# Altium schematic sheet AIRZAI_LED_SENSE_FLEX_REVA.SchDoc
size B
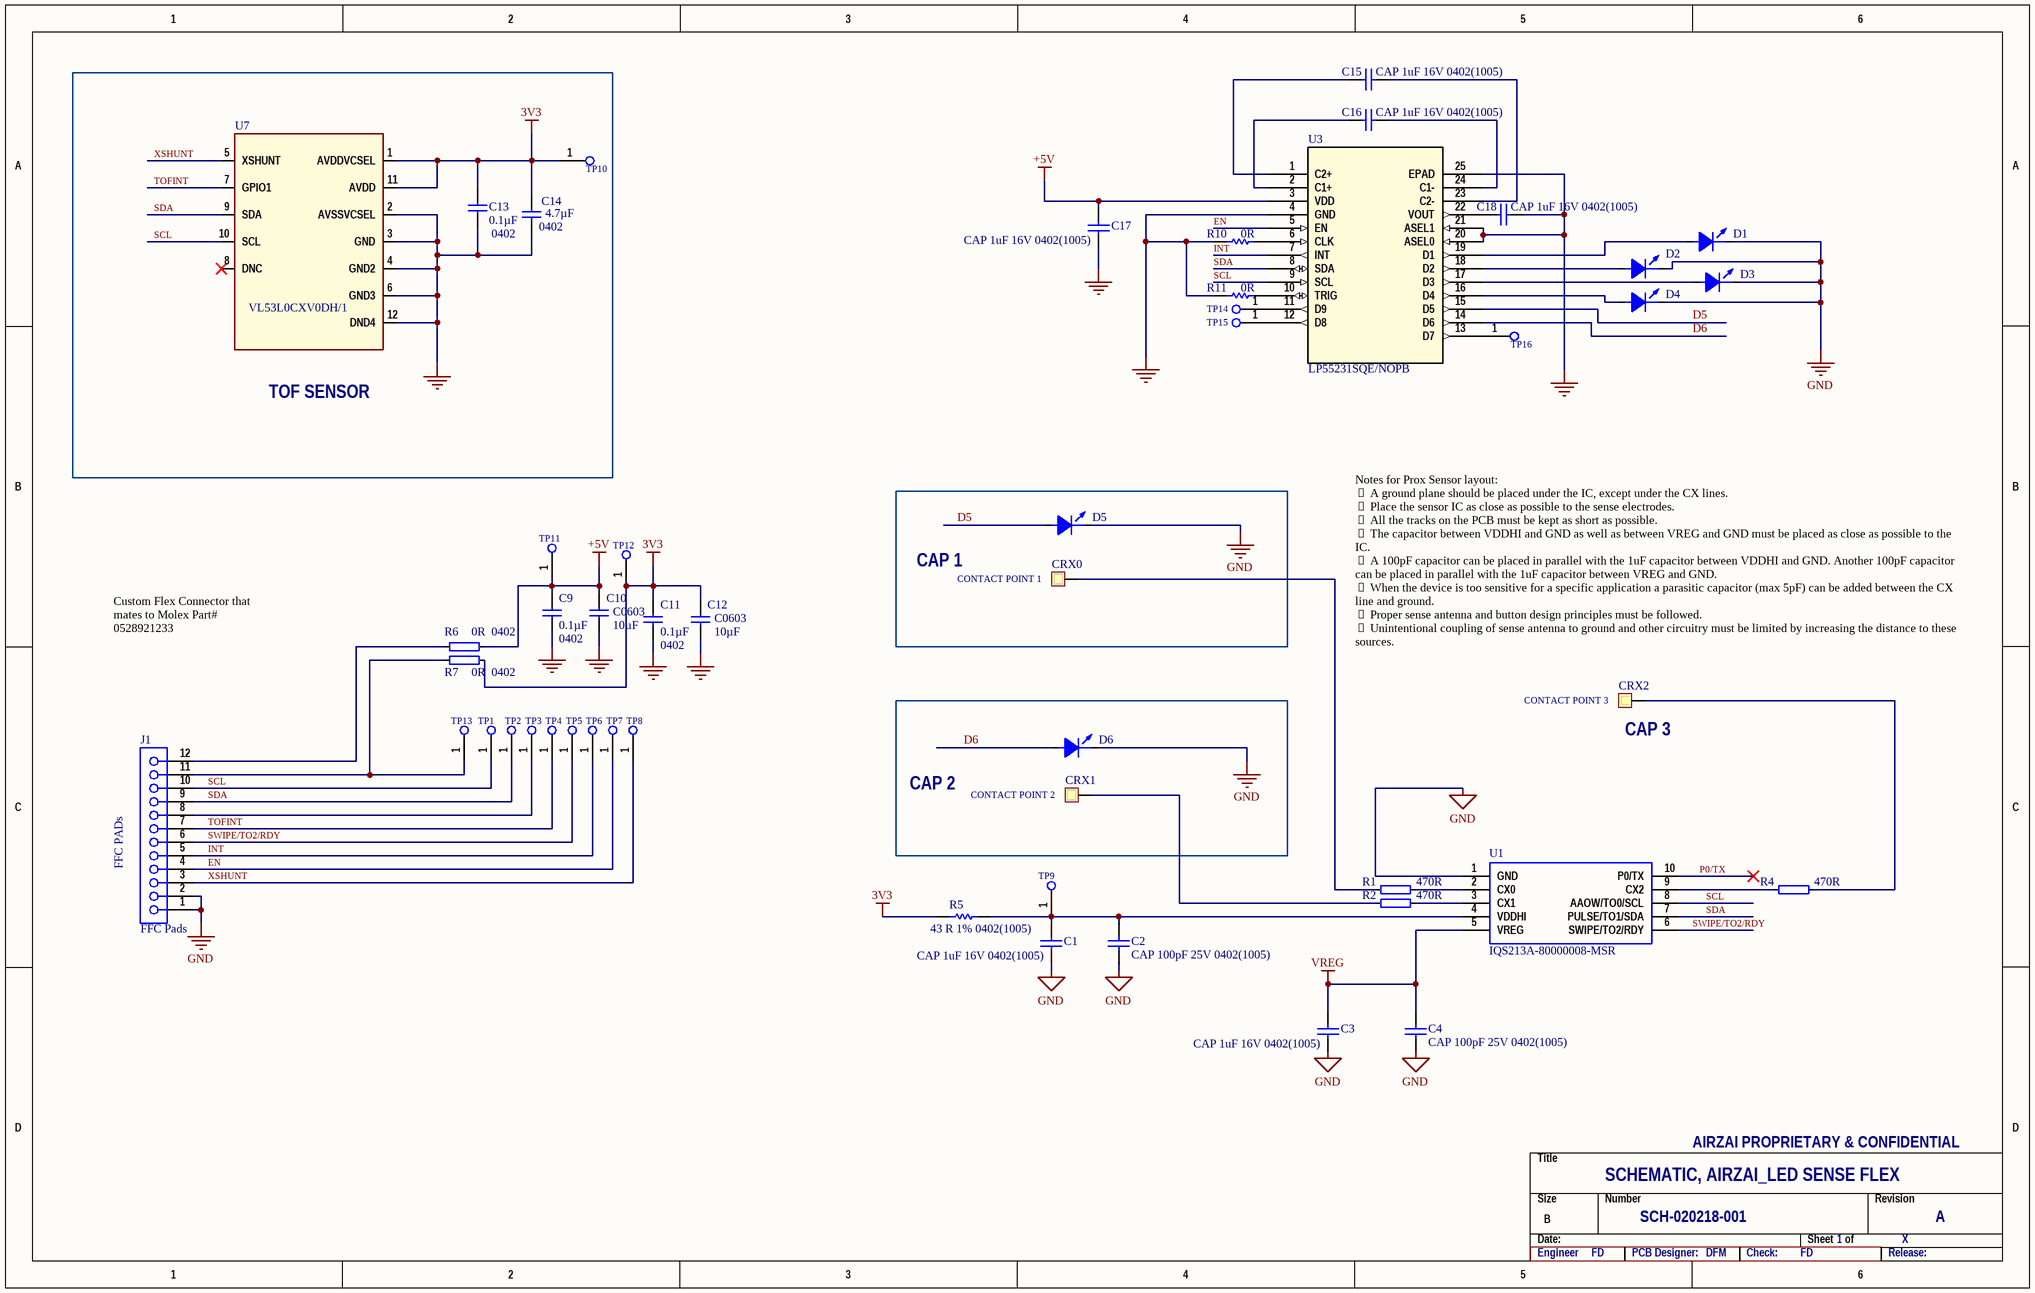
[diagram p0: AIRZAI_LED_SENSE_FLEX_REVA.SchDoc]

## Parts
C1  CAP 1uF 16V 0402(1005)  [0402-A]
C2  CAP 100pF 25V 0402(1005)  [0402-A]
C3  CAP 1uF 16V 0402(1005)  [0402-A]
C4  CAP 100pF 25V 0402(1005)  [0402-A]
C9  0.1µF  Footprint: 0402  [0402CAP]
C10  10µF  Footprint: C0603  [0603]
C11  0.1µF  Footprint: 0402  [0402CAP]
C12  10µF  Footprint: C0603  [0603]
C13  0.1µF  Footprint: 0402  [0402CAP]
C14  4.7µF  Footprint: 0402  [0603]
C15  CAP 1uF 16V 0402(1005)  [CAPC0402(1005)60_M]
C16  CAP 1uF 16V 0402(1005)  [CAPC0402(1005)60_M]
C17  CAP 1uF 16V 0402(1005)  [CAPC0402(1005)60_M]
C18  CAP 1uF 16V 0402(1005)  [CAPC0402(1005)60_M]
CRX0  CONTACT POINT 1  [CONTACT_POINT_1CM _SQ]
CRX1  CONTACT POINT 2  [CONTACT_POINT_1CM _SQ]
CRX2  CONTACT POINT 3  [CONTACT_POINT_0.7CM]
D1  WHITE  [LED1206_LTW-C230DS]  (value not drawn)
D2  WHITE  [LED1206_LTW-C230DS]  (value not drawn)
D3  WHITE  [LED1206_LTW-C230DS]  (value not drawn)
D4  WHITE  [LED1206_LTW-C230DS]  (value not drawn)
D5  WHITE  [LED1206_LTW-C230DS]  (value not drawn)
D6  WHITE  [LED1206_LTW-C230DS]  (value not drawn)
J1  FFC Pads  [FFC_Pads]
R1  470R  [0402-A]
R2  470R  [0402-A]
R4  470R  [0402-A]
R5  43 R 1% 0402(1005)  [0402-A]
R6  0R  [0402]
R7  0R  [0402]
R10  value 0R  [0402]  (hidden comment: Jumper 0402(1005))
R11  value 0R  [0402]  (hidden comment: Jumper 0402(1005))
TP1  Test Point  [TP_0.9MM]  (value not drawn)
TP2  Test Point  [TP_0.9MM]  (value not drawn)
TP3  Test Point  [TP_0.9MM]  (value not drawn)
TP4  Test Point  [TP_0.9MM]  (value not drawn)
TP5  Test Point  [TP_0.9MM]  (value not drawn)
TP6  Test Point  [TP_0.9MM]  (value not drawn)
TP7  Test Point  [TP_0.9MM]  (value not drawn)
TP8  Test Point  [TP_0.9MM]  (value not drawn)
TP9  Test Point  [TP_0.9MM]  (value not drawn)
TP10  Test Point  [TP_0.9MM]  (value not drawn)
TP11  Test Point  [TP_0.9MM]  (value not drawn)
TP12  Test Point  [TP_0.9MM]  (value not drawn)
TP13  Test Point  [TP_0.9MM]  (value not drawn)
TP14  Test Point  [TP_0.9MM]  (value not drawn)
TP15  Test Point  [TP_0.9MM]  (value not drawn)
TP16  Test Point  [TP_0.9MM]  (value not drawn)
U1  IQS213A-80000008-MSR  [MSOP-10-IQS213A-80000008-MSR]
U3  LP55231SQE/NOPB  [WQFN-24-LP55231SQE/NOPB]
U7  VL53L0CXV0DH/1  [VL53L0X]

## Blocks framed on the sheet
TOF SENSOR: C13 C14 TP10 U7
CAP 1: CRX0 D5
CAP 2: CRX1 D6

## Nets
3V3: C11.1 C12.1 C13.1 C14.2 R5.1 R7.1 TP10.1 TP12.1 U7.1(AVDDVCSEL) U7.11(AVDD)
+5V: C9.1 C10.1 C17.2 R6.1 TP11.1 U3.3(VDD)
GND: C1.1 C2.1 C3.1 C4.1 C9.2 C10.2 C11.2 C12.2 C13.2 C14.1 C17.1 C18.2 D1.1(CATHODE) D2.1(CATHODE) D3.1(CATHODE) D4.1(CATHODE) D5.1(CATHODE) D6.1(CATHODE) J1.1 J1.2 R10.1 R11.1 U1.1(GND) U3.4(GND) U3.20(ASEL0) U3.21(ASEL1) U3.25(EPAD) U7.2(AVSSVCSEL) U7.3(GND) U7.4(GND2) U7.6(GND3) U7.12(DND4)
VREG: C3.2 C4.2 U1.5(VREG)
D5: D5.2(ANODE) U3.15(D5)
D6: D6.2(ANODE) U3.14(D6)
EN: J1.4 TP7.1 U3.5(EN)
INT: J1.5 TP6.1 U3.7(INT)
P0/TX: U1.10(P0/TX)
SCL: J1.10 TP1.1 U1.8(AAOW/TO0/SCL) U3.9(SCL) U7.10(SCL)
SDA: J1.9 TP2.1 U1.7(PULSE/TO1/SDA) U3.8(SDA) U7.9(SDA)
SWIPE/TO2/RDY: J1.6 TP5.1 U1.6(SWIPE/TO2/RDY)
TOFINT: J1.7 TP4.1 U7.7(GPIO1)
XSHUNT: J1.3 TP8.1 U7.5(XSHUNT)
NetC1_2: C1.2 C2.2 R5.2 TP9.1 U1.4(VDDHI)
NetC15_1: C15.1 U3.1(C2+)
NetC15_2: C15.2 U3.23(C2-)
NetC16_1: C16.1 U3.2(C1+)
NetC16_2: C16.2 U3.24(C1-)
NetC18_1: C18.1 U3.22(VOUT)
NetCRX0_1: CRX0.1 R1.2
NetCRX1_1: CRX1.1 R2.2
NetCRX2_1: CRX2.1 R4.1
NetD1_2: D1.2(ANODE) U3.19(D1)
NetD2_2: D2.2(ANODE) U3.18(D2)
NetD3_2: D3.2(ANODE) U3.17(D3)
NetD4_2: D4.2(ANODE) U3.16(D4)
NetJ1_8: J1.8 TP3.1
NetJ1_11: J1.11 R7.2 TP13.1
NetJ1_12: J1.12 R6.2
NetR1_1: R1.1 U1.2(CX0)
NetR2_1: R2.1 U1.3(CX1)
NetR4_2: R4.2 U1.9(CX2)
NetR10_2: R10.2 U3.6(CLK)
NetR11_2: R11.2 U3.10(TRIG)
NetTP14_1: TP14.1 U3.11(D9)
NetTP15_1: TP15.1 U3.12(D8)
NetTP16_1: TP16.1 U3.13(D7)

Not connected (* = marked no-connect by the designer): U7 8(DNC)*

## Notes on the sheet
- Custom Flex Connector that mates to Molex Part# 0528921233
- (near CRX2) Notes for Prox Sensor layout:
   A ground plane should be placed under the IC, except under the CX lines.
   Place the sensor IC as close as possible to the sense electrodes.
   All the tracks on the PCB must be kept as short as possible.
   The capacitor between VDDHI and GND as well as between VREG and GND must be placed as close as possible to the IC.
   A 100pF capacitor can be placed in parallel with the 1uF capacitor between VDDHI and GND. Another 100pF capacitor can be placed in parallel with the 1uF capacitor between VREG and GND.
   When the device is too sensitive for a specific application a parasitic capacitor (max 5pF) can be added between the CX line and ground.
   Proper sense antenna and button design principles must be followed.
   Unintentional coupling of sense antenna to ground and other circuitry must be limited by increasing the distance to these sources.
- (near CRX2) CAP 3
- (near J1) FFC PADs
- SCHEMATIC, AIRZAI_LED SENSE FLEX
- AIRZAI PROPRIETARY & CONFIDENTIAL
- SCH-020218-001
- 1
- X
- A
- Engineer
- FD
- PCB Designer:
- DFM
- Check:
- Release:

## Library data of the parts
C1 C3 C15-C18 = CAP: CAP 1uF 16V ±10% 0402 (1005 Metric) Thickness 0.6mm SMD; Manufacturer: Taiyo Yuden; Manufacturer Part Number: JMK105C6105KV-F; Case-EIA: 0402; Rated Voltage: 6.3 V; Tolerance: Â±10%; Case-Metric: 1005; Note: CAP CER 1UF 6.3V X6S 0402; Technology: SMT; Max Thickness: 0.6 mm; Value: 1uF; Pin Count: 2; Supplier 1: Digi-Key; Supplier Part Number 1: 587-3381-1-ND
C2 C4 = CAP: CAP 100pF 25V ±2% 0402 (1005 Metric) Thickness 0.6mm SMD; Manufacturer: Yageo; Manufacturer Part Number: CC0402JRNPO9BN101; Tolerance: Â±2%; Case-Metric: 1005; Case-EIA: 0402; Note: CAP CER 100PF 50V C0G/NPO 0402; Max Thickness: 0.6 mm; Technology: SMT; Rated Voltage: 25 V; Value: 100pF; Pin Count: 2; Supplier 1: Digi-Key; Supplier Part Number 1: 311-1024-1-ND
C9 C11 C13 = C0402-100n: Capacitor, X7R, ±10%; Manufacturer: TDK; Manufacturer Part Number: C1005X7R1C104K; Note: 16V ±10% X7R; Case-Metric: 1005; Rated Voltage: 16 V; Tolerance: Â±20%; Datasheet: *; Pin Count: 2; Value: 0.1µF; Supplier: *; Supplier part number: *; 2nd source Supplier: *; 2nd source part number: *; Case-EIA: 0402; Max Thickness: 0.6 mm; Supplier 1: Digi-Key; Supplier Part Number 1: 445-4952-2-ND; Technology: SMT
C10 C12 = C0402-100n: Capacitor, X7R, ±10%; Manufacturer: MURATA; Manufacturer Part Number: GRM188R60J106ME47D; Note: 6.3volts X5R 20%; Case-Metric: 1608; Rated Voltage: 6.3 V; Tolerance: Â±20%; Value: 10µF; Case-EIA: 0603; Max Thickness: 0.9 mm; Pin Count: 2; Supplier 1: Digi-Key; Supplier Part Number 1: 490-3896-6-ND; Technology: SMT
C14 = C0603-1µ0 X7R: Capacitor, X7R, ±10%; Manufacturer: TDK; Manufacturer Part Number: C1005X5R0J475M; Case-Metric: 1005; Note: 6.3volts X5R 20%; Rated Voltage: 6.3 V; Tolerance: Â±20%; Value: 4.7µF; Case-EIA: 0402; Max Thickness: 0.6 mm; Supplier 1: Digi-Key; Supplier Part Number 1: 445-7395-2-ND; Technology: SMT
CRX0-CRX2 = WIRE_POINT
D1-D6 = LED_LTW-C230DS: Manufacturer: LITEON; Note: REVERSE MOUNT CHIP LED; Case-EIA: 1206; Case-Metric: 3216; Manufacturer Part Number: LTW-C230DS; Value: WHITE; Footprint: LED_LTW-C230DS; Supplier 1: Digi-Key; Supplier Part Number 1: 160-2221-1-ND; Max Thickness: 1.10mm
J1 = FFC_PADS: 0.5 mm Pitch FFC Pads; Note: DNP; ComponentLink2URL: http://www.molex.com/webdocs/datasheets/pdf/en-us/0528921233_FFC_FPC_CONNECTORS.pdf; ComponentLink1URL: http://www.molex.com/molex/index.jsp; ComponentLink3URL: http://www.molex.com/pdm_docs/sd/528921233_sd.pdf; ComponentLink2Description: Datasheet; ComponentLink3Description: Package Specification
R1 R2 R4 = R0402-12k: Resistor, ±1%, 0.063W; Manufacturer: Panasonic; Manufacturer Part Number: ERJ-2RKF4700X; Note: RES SMD 470 OHM 1% 1/10W 0402; Case-EIA: 0402; Case-Metric: 1005; Footprint: 0402; Value: 470R; Max Thickness: 0.4 mm; Supplier 1: Digi-Key; Supplier Part Number 1: P470LTR-ND; Technology: SMT; Tolerance: ±1%
R5 = RES: 43R2 0.063W 1% 0402 (1005 Metric)  SMD; Manufacturer: Panasonic; Manufacturer Part Number: ERJ-2RKF43R0X; Case-Metric: 1005; Case-EIA: 0402; Value: 43 R; Note: Res SMD 43 OHM 1% 1/10W 0402; Tolerance: 1 %; Power: 0.063 W; Technology: SMT; Max Thickness: 0.4 mm; Supplier 1: Digi-Key; Supplier Part Number 1: P43.0LCT-ND
R6 R7 = R0402-12k: Resistor, ±1%, 0.063W; Manufacturer: Panasonic; Manufacturer Part Number: ERJ-2GE0R00X; Note: 0.1W JUMPER; Case-Metric: 1005; Tolerance: None; Datasheet: *; Pin Count: 2; Value: 0R; 2nd source Supplier: *; 2nd source part number: *; Case-EIA: 0402; Max Thickness: 0.6 mm; Supplier 1: Digi-Key; Technology: SMT
  R6: Supplier Part Number 1: P0.0JTR-ND
  R7: Supplier Part Number 1: P0.0JCT-ND
R10 R11 = RES: Jumper 0402 (1005 Metric); Manufacturer: Panasonic; Manufacturer Part Number: ERJ-2GE0R00X; Tolerance: None; Case-Metric: 1005; Note: 0.1W JUMPER; Power: None; Case-EIA: 0402; Technology: SMT; Max Thickness: 0.6 mm; Pin Count: 2; Supplier 1: Digi-Key; Supplier Part Number 1: P0.0JCT-ND
U1 = IQS213A-80000008-MSR: Capacitive Touch Sensors 3 Ch Capacitive Touch/Swipe Function; Manufacturer_Name: Azoteq; Manufacturer Part Number: IQS213A-00000000-MSR; Geometry.Height: 1.05mm; Case-EIA: 10-MSOP; Note: 3 CH. CAPACITIVE TOUCH SENSOR WI; Tolerance: None; Value: 3 CH. CAPACITIVE TOUCH SENSOR WI; Manufacturer_Part_Number: IQS213A-80000008-MSR; RS Part Number: *; RS Price/Stock: *; Arrow Part Number: IQS213A-80000008-MSR; Arrow Price/Stock: *; Datasheet Link: https://componentsearchengine.com/Datasheets/1/IQS213A-80000008-MSR.pdf; Manufacturer: Azoteq; Pin Count: 10; Supplier 1: Digi-Key; Supplier Part Number 1: 1790-1031-1-ND; Technology: SMT
U3 = LP55231SQE/NOPB: Imported; Manufacturer: TI; Vendor: Texas Instruments; Built_By: EMA_UL_Team; Value: IC LED DRIVER RGLTR DIM 24WQFN; C: Copyright (C) 2016 Accelerated Designs. All rights reserved; Case-EIA: 24-WQFN; Tolerance: None; Manufacturer_Part_Number: LP55231SQE/NOPB; RefDes: RefDes; Type: DEV; Manufacturer Part Number: LP55231SQE/NOPB; Note: IC LED DRIVER RGLTR DIM 24WQFN; Supplier 1: Digi-Key; Supplier Part Number 1: 296-39059-1-ND; Technology: SMT
U7 = VL53L0X: Manufacturer: ST; Note: SENSOR LASER DISTANCE TOF 2M; Case-EIA: LGA12; Tolerance: None; Manufacturer Part Number: VL53L0CXV0DH/1; Value: VL53L0CXV0DH/1; Supplier 1: Digi-Key; Supplier Part Number 1: 497-16538-1-ND; Technology: SMT